# EAGLE design mubi-bot-PICO-2 (EAGLE 7.2.0)
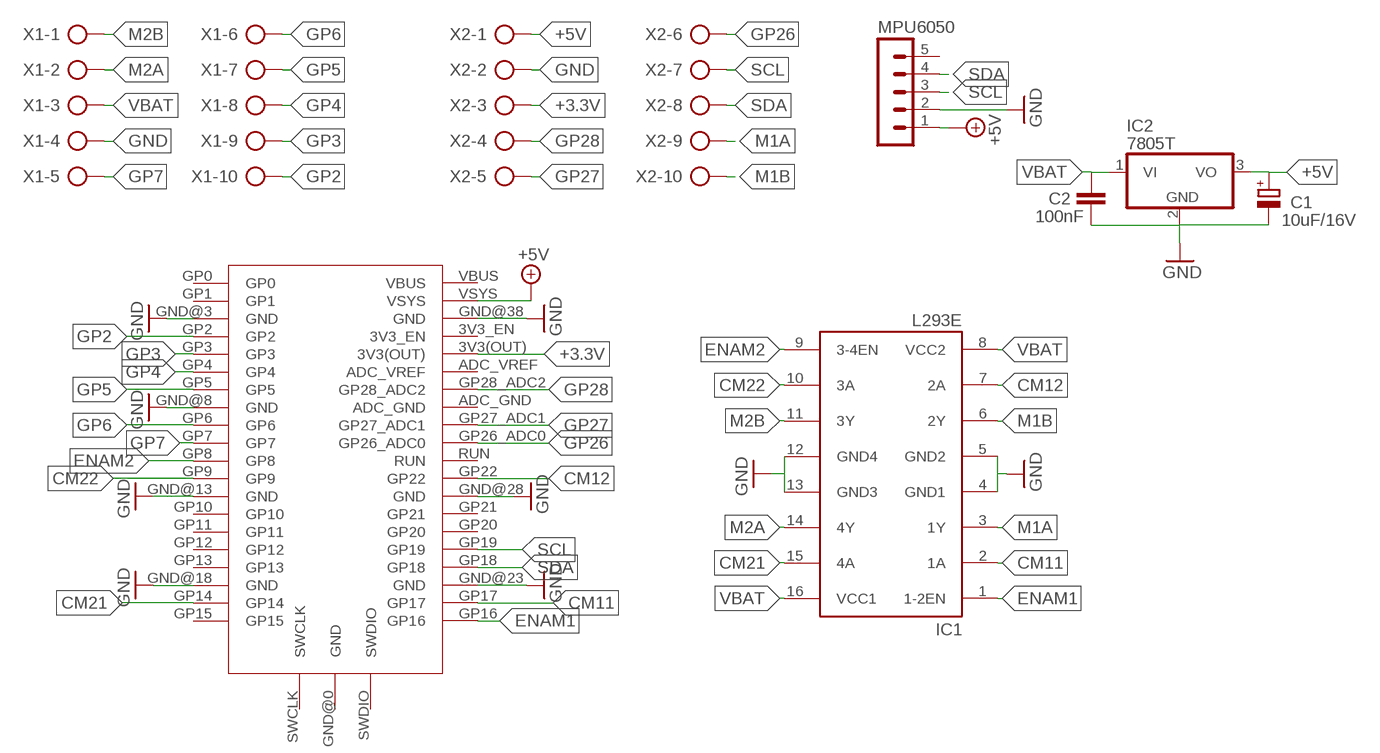
[diagram p0: schematic, sheet 1]

## Parts
C1  10uF/16V  CPOL-EUE2.5-5  [E2,5-5]
C2  100nF  C-EU025-025X050  [C025-025X050]
IC1  L293E  [DIL16]
IC2  7805T  [TO220H]
MPU6050  MA05-1  [MA05-1]
U$2  RASPBERRY_PI_PICO  [RASPBERRY_PI_PICO_FOOTPRINT]
X1  AK500/10-H  [AK500/10-H]
X2  AK500/10-H  [AK500/10-H]

## Nets
+3.3V: U$2.3V3(OUT) X2.3
+5V: C1.+ IC2.3(VO) MPU6050.1 U$2.VSYS X2.1
CM11: IC1.2(1A) U$2.GP17
CM12: IC1.7(2A) U$2.GP22
CM21: IC1.15(4A) U$2.GP14
CM22: IC1.10(3A) U$2.GP9
ENAM1: IC1.1(1-2EN) U$2.GP16
ENAM2: IC1.9(3-4EN) U$2.GP8
GND: C1.- C2.2 IC1.4(GND1) IC1.5(GND2) IC1.12(GND4) IC1.13(GND3) IC2.2(GND) MPU6050.2 U$2.GND@3(GND) U$2.GND@8(GND) U$2.GND@13(GND) U$2.GND@18(GND) U$2.GND@23(GND) U$2.GND@28(GND) U$2.GND@38(GND) X1.4 X2.2
GP2: U$2.GP2 X1.10
GP3: U$2.GP3 X1.9
GP4: U$2.GP4 X1.8
GP5: U$2.GP5 X1.7
GP6: U$2.GP6 X1.6
GP7: U$2.GP7 X1.5
GP26: U$2.GP26_ADC0 X2.6
GP27: U$2.GP27_ADC1 X2.5
GP28: U$2.GP28_ADC2 X2.4
M1A: IC1.3(1Y) X2.9
M1B: IC1.6(2Y) X2.10
M2A: IC1.14(4Y) X1.2
M2B: IC1.11(3Y) X1.1
SCL: MPU6050.3 U$2.GP19 X2.7
SDA: MPU6050.4 U$2.GP18 X2.8
VBAT: C2.1 IC1.8(VCC2) IC1.16(VCC1) IC2.1(VI) X1.3
Unconnected: MPU6050.5 U$2.3V3_EN U$2.ADC_GND U$2.ADC_VREF U$2.GND@0(GND) U$2.GP0 U$2.GP1 U$2.GP10 U$2.GP11 U$2.GP12 U$2.GP13 U$2.GP15 U$2.GP20 U$2.GP21 U$2.RUN U$2.SWCLK U$2.SWDIO U$2.VBUS

## Library data of the parts
C1 = rcl:CPOL-EU: POLARIZED CAPACITOR, European symbol
C2 = rcl:C-EU: CAPACITOR, European symbol
IC1 = texas:L293E: TI DEVICE; MF: Arrow Electronics; MPN: L293E; OC_FARNELL: 1467711; OC_NEWARK: 89K0732
IC2 = linear:78*: Positive VOLTAGE REGULATOR Source: http://cache.national.com/ds/LM/LM78L05.pdf http://www.fairchildsemi.com/ds/LM/LM7805.pdf
MPU6050 = con-lstb:MA05-1: PIN HEADER; OC_FARNELL: unknown; OC_NEWARK: unknown
U$2 = Raspberry Pi Pico v1:RASPBERRY_PI_PICO
X1 X2 = con-ptr500:AK500/10-H: CONNECTOR Aug. 2004 / PTR Meßtechnik: Die Bezeichnung der Serie AK505 wurde geändert. Es handelt sich hierbei um AK500 in horizontaler Ausführung.; OC_FARNELL: unknown; OC_NEWARK: unknown

## Net classes
0 default: clearance 0.205 mm

## Board
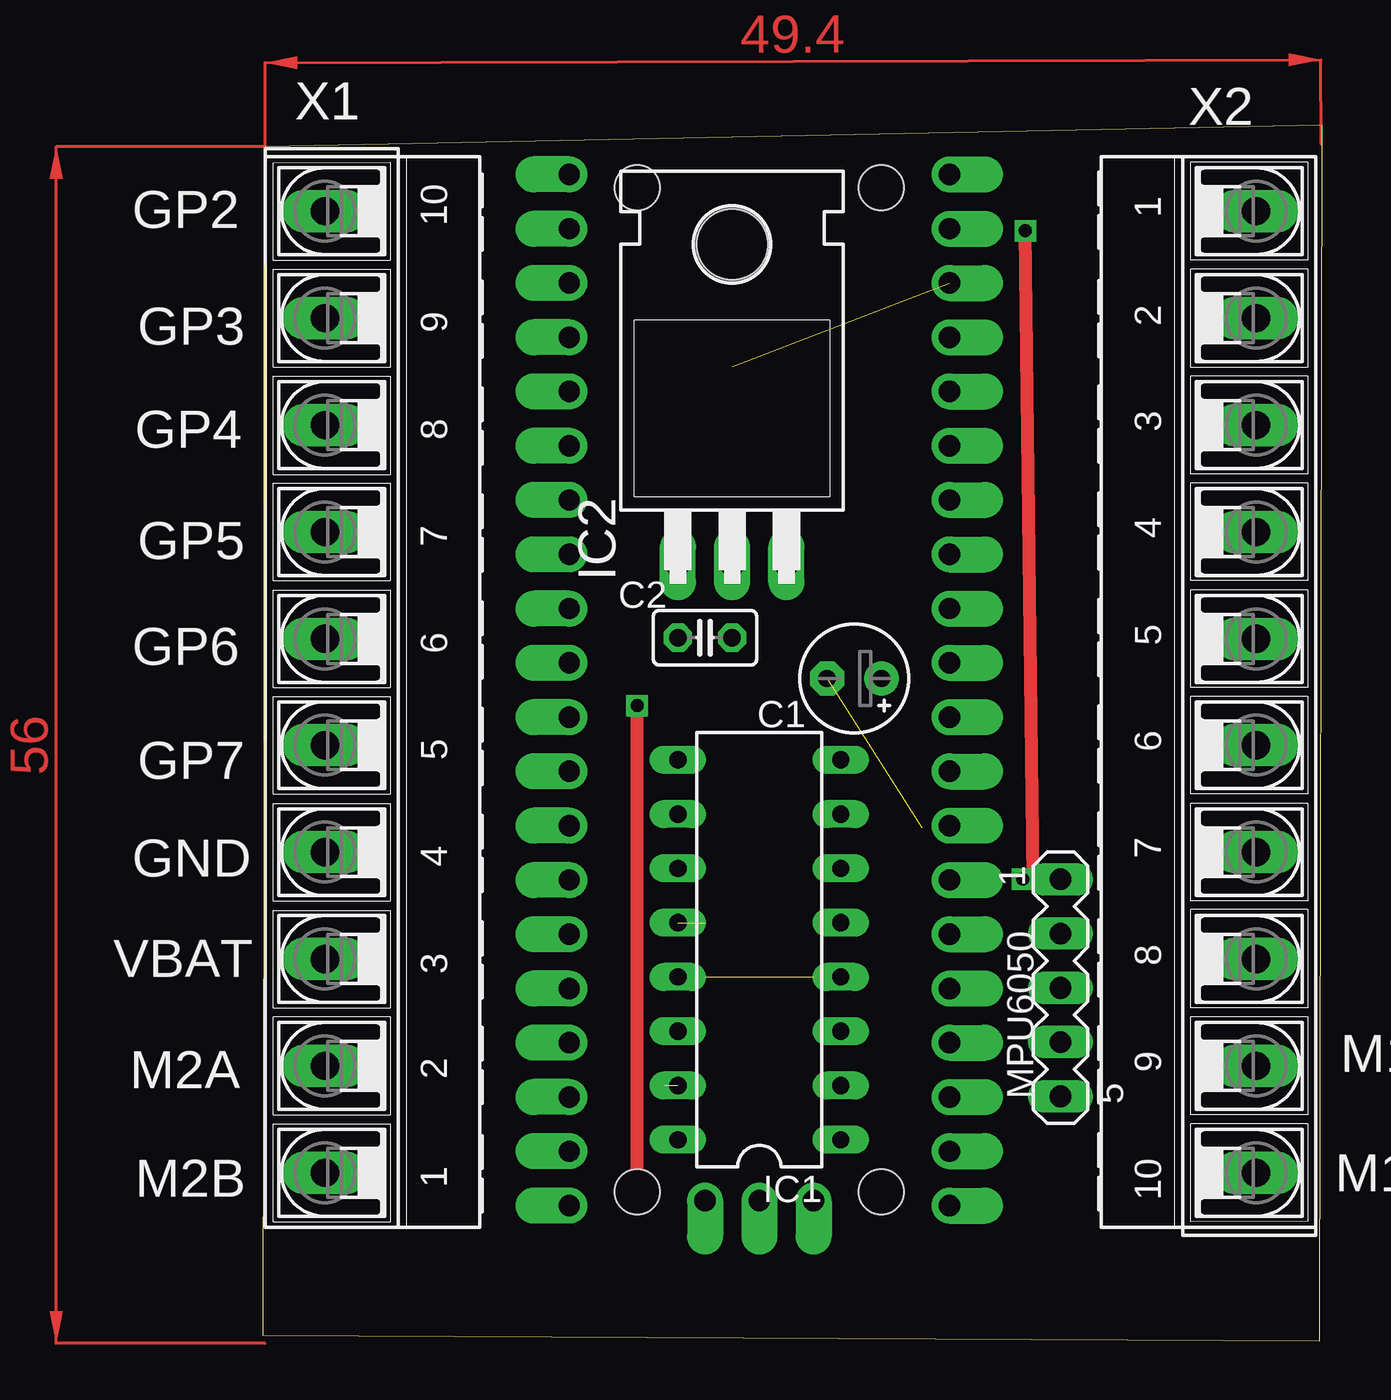
[diagram p1: board, top side]
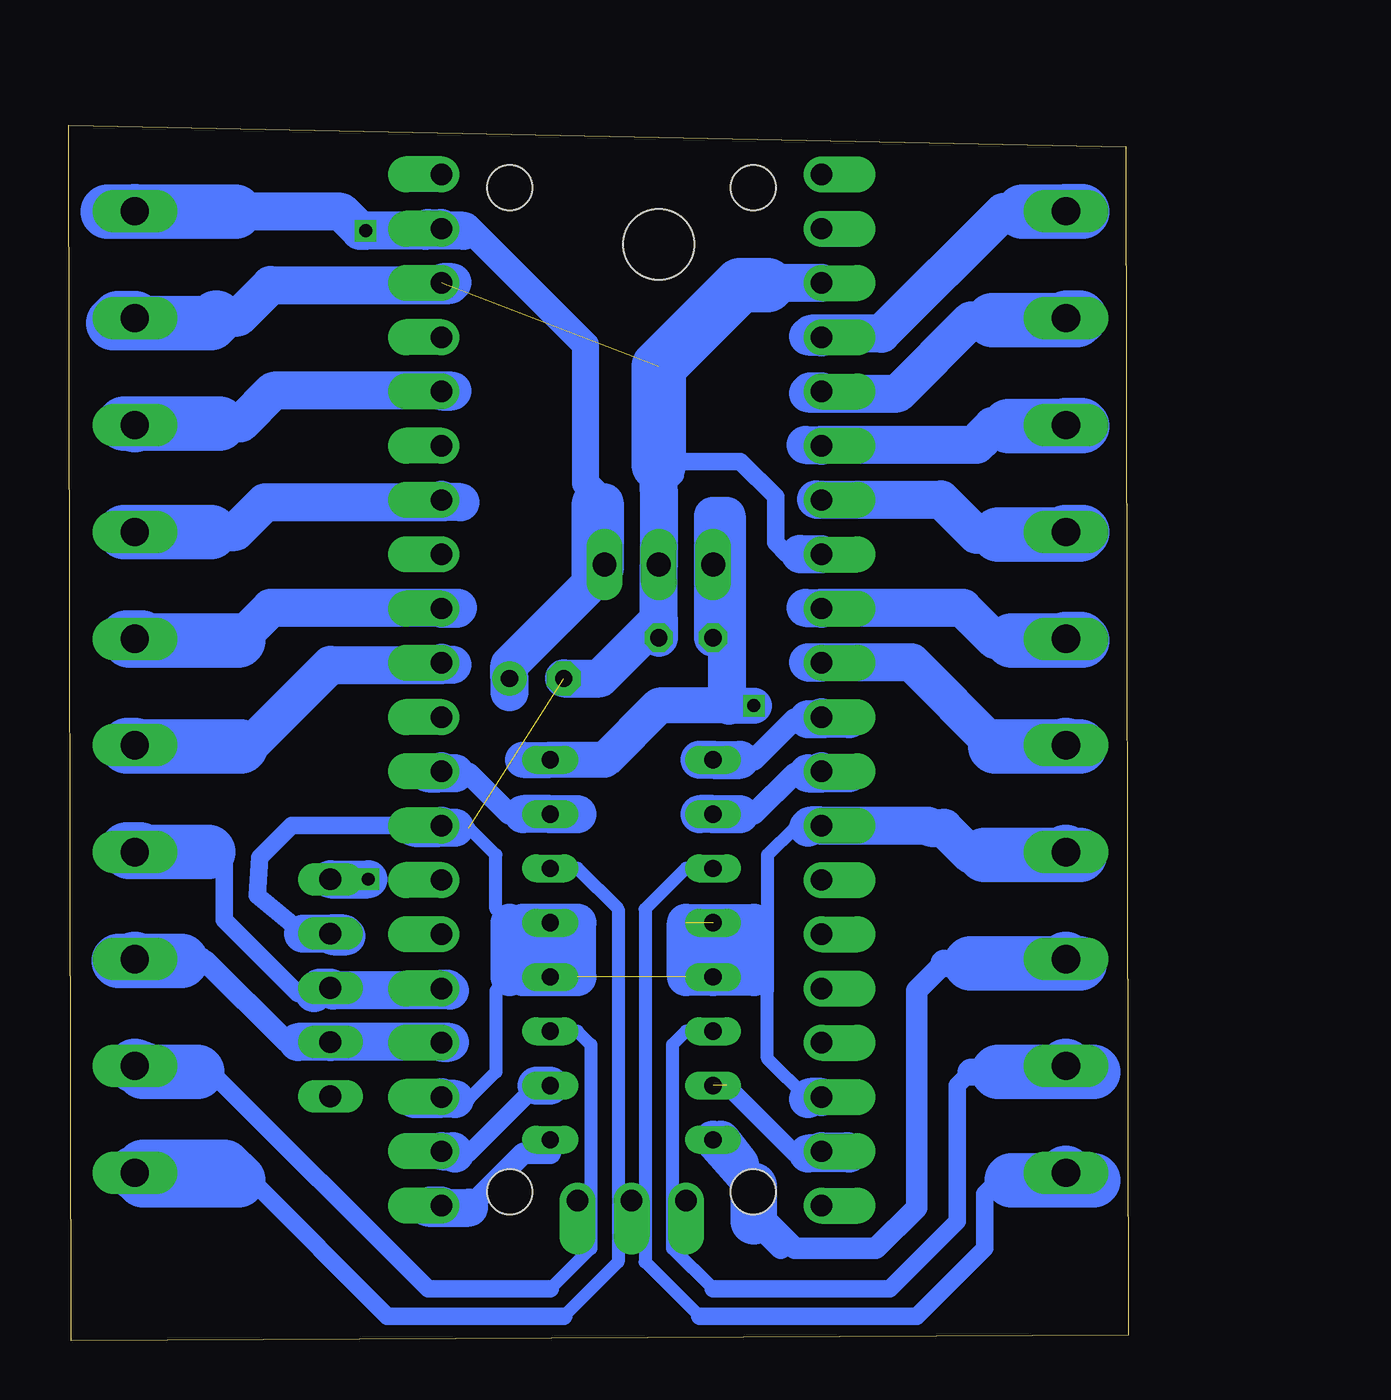
[diagram p2: board, bottom side, seen from below]

Size 49.58 x 56.89 mm. Coordinates in mm from the lower left corner, seen from the top.
Outline: 0,0.25 49.45,0 49.58,56.89 0.13,55.87 0,0.25
Copper layers (1*16): Top 0.035mm / dielectric 1.5mm / Bottom 0.035mm
Design rules "default": minimum track width 6mil, minimum drill 0.35mm, track to track 6mil, track to pad 6mil, pad to pad 6mil, via to via 6mil, smd to smd 6mil, copper to edge 40mil, drill to drill 6mil, minimum pad ring 10mil, minimum via ring 8mil, stop-mask expansion 4mil, vias tented up to drill 0mil, thermal gap 10mil

### Footprints (pad centres in the part's own frame; a part is rotated, then mirrored left to right if it is on the bottom)
E2,5-5 = drill 0.813 pad 1.6: + -1.27,0 | drill 0.813 pad 1.6 octagon: - 1.27,0
C025-025X050 = drill 0.813 octagon: 1 -1.27,0; 2 1.27,0
DIL16 = drill 0.813 long: 1 -8.89,-3.81; 2 -6.35,-3.81; 3 -3.81,-3.81; 4 -1.27,-3.81; 5 1.27,-3.81; 6 3.81,-3.81; 7 6.35,-3.81; 8 8.89,-3.81; 9 8.89,3.81; 10 6.35,3.81; 11 3.81,3.81; 12 1.27,3.81; 13 -1.27,3.81; 14 -3.81,3.81; 15 -6.35,3.81; 16 -8.89,3.81
TO220H = drill 1.118 long: 1 -2.54,-10.16; 2 0,-10.16; 3 2.54,-10.16 | hole 3.302: 0,4.826
MA05-1 = drill 1.016 long: 1 -5.08,0; 2 -2.54,0; 3 0,0; 4 2.54,0; 5 5.08,0
RASPBERRY_PI_PICO_FOOTPRINT = drill 1 pad 1.676 offset: 3V3(OUT) 8.89,39.465; 3V3_EN 8.89,42.005; ADC_GND 8.89,31.845; ADC_VREF 8.89,36.925; GND@0 0,1.6; GND@3 -8.89,44.545; GND@8 -8.89,31.845; GND@13 -8.89,19.145; GND@18 -8.89,6.445; GND@23 8.89,6.445; GND@28 8.89,19.145; GND@38 8.89,44.545; GP0 -8.89,49.625; GP1 -8.89,47.085; GP2 -8.89,42.005; GP3 -8.89,39.465; GP4 -8.89,36.925; GP5 -8.89,34.385; GP6 -8.89,29.305; GP7 -8.89,26.765; GP8 -8.89,24.225; GP9 -8.89,21.685; GP10 -8.89,16.605; GP11 -8.89,14.065; GP12 -8.89,11.525; GP13 -8.89,8.985; GP14 -8.89,3.905; GP15 -8.89,1.365; GP16 8.89,1.365; GP17 8.89,3.905; GP18 8.89,8.985; GP19 8.89,11.525; GP20 8.89,14.065; GP21 8.89,16.605; GP22 8.89,21.685; GP26_ADC0 8.89,26.765; GP27_ADC1 8.89,29.305; GP28_ADC2 8.89,34.385; RUN 8.89,24.225; SWCLK -2.54,1.6; SWDIO 2.54,1.6; VBUS 8.89,49.625; VSYS 8.89,47.085 | hole 2.1: 5.7,2; 5.7,49; -5.7,49; -5.7,2
AK500/10-H = drill 1.321 long: 1 -22.504,0; 2 -17.501,0; 3 -12.497,0; 4 -7.493,0; 5 -2.489,0; 6 2.489,0; 7 7.493,0; 8 12.497,0; 9 17.501,0; 10 22.504,0

### Placement (x,y rotation side)
C1  27.69,30.99 180 top
C2  20.7,32.89 0 top
IC1  23.24,18.29 90 top
IC2  21.97,46.48 0 top
MPU6050  37.34,16.51 270 top
U$2  23.24,4.95 0 top
X1  2.92,30.35 90 top
X2  46.48,30.35 270 top

### Tracks (layer width: path | path; a pad name or v marks a point on that pad's centre or on a via)
+3.3V
  Bottom 1.778: U$2.3V3(OUT) 31.65,44.42 31.62,44.45 40,44.45 41.53,42.93 42.54,42.93
  Bottom 2.54: 42.54,42.93 46.18,42.93 | 46.99,42.93 46.18,42.93 | 46.18,42.93 X2.3
+5V  (via drill 0.6)
  Top 0.61: v35.56,21.59 36.07,21.59 v35.69,51.94
  Bottom 1.27: IC2.3 24.51,39.24 25.4,40.13 25.4,46.59 30.74,51.93 31.11,51.93 31.11,51.94
  Bottom 1.778: 28.96,30.35 C1.+ 28.96,31.62 25.15,35.43 | 25.15,35.43 24.51,36.07 24.51,39.24 25.15,39.24 | 25.15,35.43 25.15,39.24 | IC2.3 24.51,38.61 25.15,39.24 | 31.11,51.94 32.89,51.94 | 32.89,51.94 32.77,52.07 32.16,52.07 U$2.VSYS | MPU6050.1 v35.56,21.59 | 32.89,51.94 v35.69,51.94 35.94,51.94 36.83,52.83 41.78,52.83
  Bottom 2.54: 41.78,52.83 46.13,52.83 | 47.75,52.83 46.13,52.83 | 46.13,52.83 X2.1
CM11
  Bottom 0.813: 31.5,8.76 30.86,8.76 27.69,11.94
  Bottom 1.778: U$2.GP17 31.59,8.86 31.5,8.76 | 27.69,11.94 IC1.2
CM12
  Bottom 1.016: 28.32,24.64 28.96,24.64 30.86,26.54 31.5,26.54
  Bottom 1.778: 25.78,24.64 IC1.7 28.32,24.64 | 31.5,26.54 32.23,26.54 | 32.77,26.54 32.23,26.54 | 32.23,26.54 U$2.GP22
CM21  (1 unrouted)
  Bottom 0.813: 14.99,8.76 15.62,8.76 18.8,11.94
  Bottom 1.778: U$2.GP14 13.18,8.86 13.08,8.76 14.99,8.76
CM22
  Bottom 1.016: 18.16,24.64 17.53,24.64 15.62,26.54 14.99,26.54
  Bottom 1.778: 20.07,24.64 IC1.10 18.16,24.64 | 14.99,26.54 14.26,26.54 | 13.08,26.54 14.26,26.54 | 14.26,26.54 U$2.GP9
ENAM1
  Bottom 1.016: 30.86,6.22 28.32,8.76 27.05,8.76 IC1.1
  Bottom 1.778: U$2.GP16 32.67,6.32 32.77,6.22 30.86,6.22
ENAM2
  Bottom 1.016: 18.16,27.18 17.53,27.18 15.62,29.08 14.99,29.08
  Bottom 1.778: 20.07,27.18 IC1.9 18.16,27.18 | 14.99,29.08 14.26,29.08 | 13.08,29.08 14.26,29.08 | 14.26,29.08 U$2.GP8
GND  (4 unrouted)
  Bottom 0.61: 14.99,11.3 16.89,13.21 16.89,16.38 | 16.89,16.38 17.53,17.02 | 14.99,24 15.62,24 16.89,22.73 16.89,16.38 | 28.32,19.56 28.96,19.56 29.59,20.19 29.59,22.73 30.86,24 31.5,24 | 28.96,17.02 29.59,16.38 29.59,12.57 30.86,11.3 31.5,11.3
  Bottom 0.813: 15.37,36.83 16,36.83 16.51,37.34 16.51,39.5 18.16,41.15 21.21,41.15 21.21,40.49 21.97,39.73 | U$2.GND@28 39.15,24.1 40.64,22.61 40.77,20.83 38.61,19.05
  Bottom 1.778: U$2.GND@18 14.89,11.4 14.99,11.3 | IC1.13 17.53,17.02 17.53,17.65 | IC1.13 20.7,17.02 20.7,19.56 17.53,19.56 17.53,17.65 | 17.53,17.65 18.16,18.29 19.43,18.29 IC1.13 | 28.32,17.02 28.32,19.56 IC1.5 25.78,19.56 25.78,17.02 IC1.4 28.32,17.02 | 14.99,24 14.89,24.1 U$2.GND@13 9.37,24.1 9.27,24 8.64,24 7.37,22.73 6.73,22.73 | 31.5,24 32.23,24 | 33.4,24 32.23,24 | 32.23,24 U$2.GND@28 | 28.32,17.02 27.05,18.29 27.69,18.29 28.96,19.56 28.96,17.02 | 31.5,11.3 32.23,11.3 | 33.4,11.3 32.23,11.3 | 32.23,11.3 U$2.GND@23 | 21.97,33.74 C2.2 | 21.97,33.74 IC2.2 21.97,39.73 21.97,41 21.97,43.69 | C1.- 24.73,30.99 21.97,33.74 | U$2.GND@3 16.8,49.5 16.89,49.4 | U$2.GND@8 15.34,36.8 15.37,36.83 | 38.61,19.05 MPU6050.2 | MPU6050.2 36.7,19.05 36.58,18.92 37.21,18.92 MPU6050.2 | 42.67,47.88 41.66,47.88 40.13,49.4 31.75,49.4 31.62,49.53 32.1,49.53 U$2.GND@38
  Bottom 2.54: 6.73,22.73 2.79,22.73 | 2.29,22.73 2.79,22.73 | 2.79,22.73 X1.4 | 16.89,49.4 18.16,49.4 21.97,45.59 21.97,41 | X2.2 47.27,47.85 47.5,47.62 42.93,47.62 42.67,47.88
GP2
  Bottom 1.778: 4.95,52.83 5.84,52.83 11.56,47.12 14.86,47.12 14.99,46.99 14.38,46.99 U$2.GP2
  Bottom 2.54: X1.10 2.18,52.86 2.16,52.83 4.95,52.83
GP3
  Bottom 1.778: U$2.GP3 14.89,44.42 14.99,44.32 10.79,44.32 7.37,47.75 6.35,47.75
  Bottom 2.54: 6.35,47.75 2.41,47.75 2.29,47.88 2.9,47.88 X1.9
GP4
  Bottom 1.778: 5.59,42.8 6.35,42.8 6.86,42.29 6.86,42.16 7.11,41.91 14.38,41.91 | 15.11,41.91 14.38,41.91 | 14.38,41.91 U$2.GP4
  Bottom 2.54: X1.8 2.21,42.85 2.16,42.8 5.59,42.8
GP5
  Bottom 1.778: U$2.GP5 14.57,39.34 14.61,39.37 8.76,39.37 7.11,37.72 6.1,37.72
  Bottom 2.54: 6.1,37.72 2.29,37.72 2.16,37.85 X1.7
GP6
  Bottom 1.778: 5.46,32.77 6.22,32.77 7.75,34.29 14.38,34.29 | 15.11,34.29 14.38,34.29 | 14.38,34.29 U$2.GP6
  Bottom 2.54: X1.6 2.24,32.84 2.16,32.77 5.46,32.77
GP7
  Bottom 1.778: U$2.GP7 14.95,31.72 14.99,31.75 10.16,31.75 6.22,27.81
  Bottom 2.54: 6.22,27.81 2.87,27.81 | 2.29,27.81 2.87,27.81 | 2.87,27.81 X1.5
GP26
  Bottom 1.778: 41.53,27.81 41.15,27.81 37.34,31.62 32.04,31.62 | 31.62,31.62 32.04,31.62 | 32.04,31.62 U$2.GP26_ADC0
  Bottom 2.54: X2.6 46.81,27.86 46.86,27.81 41.53,27.81
GP27
  Bottom 1.778: U$2.GP27_ADC1 31.4,34.26 31.37,34.29 40.13,34.29 41.66,32.77
  Bottom 2.54: 41.66,32.77 46.74,32.77 46.86,32.89 46.15,32.89 X2.5
GP28
  Bottom 1.778: 42.93,37.85 41.78,37.85 40.39,39.24 32.04,39.24 | 31.24,39.24 32.04,39.24 | 32.04,39.24 U$2.GP28_ADC2
  Bottom 2.54: 46.99,37.85 X2.4 42.93,37.85
M1A
  Bottom 0.61: IC1.3 25.78,14.48 25.15,13.84 25.15,4.32 27.05,2.41
  Bottom 0.813: 27.05,2.41 32.77,2.41 42.93,12.57 43.56,12.57
  Bottom 2.54: 43.56,12.57 45.74,12.57 | 46.1,12.57 45.74,12.57 | 45.74,12.57 X2.9
M1B
  Bottom 0.61: IC1.6 25.78,22.1 23.88,20.19 23.88,3.68 26.42,1.14
  Bottom 0.813: 26.42,1.14 34.67,1.14 41.02,7.49 41.66,7.49
  Bottom 2.54: 45.11,7.49 46.1,7.49 46.1,8.13 42.29,8.13 41.66,7.49 45.11,7.49 | 45.11,7.49 X2.10
M2A
  Bottom 0.61: IC1.14 20.7,14.48 21.34,13.84 21.34,4.32 19.43,2.41
  Bottom 0.813: 19.43,2.41 11.18,2.41 8,5.59 8,11.94 7.37,12.57
  Bottom 1.27: 7.37,12.57 6.1,12.57
  Bottom 2.54: 6.1,12.57 2.64,12.57 | 1.65,12.57 2.64,12.57 | 2.64,12.57 X1.2
M2B
  Bottom 0.61: IC1.11 20.7,22.1 22.61,20.19 22.61,3.68 20.07,1.14
  Bottom 0.813: 20.07,1.14 9.91,1.14 6.73,4.32 6.73,6.86 6.1,7.49 5.46,7.49
  Bottom 2.54: 5.46,7.49 2.57,7.49 | 1.65,7.49 2.57,7.49 | 2.57,7.49 X1.1
SCL
  Bottom 0.813: 38.1,16.26 38.86,16.26 42.29,19.68 42.29,22.48 43.18,22.86 43.05,22.86
  Bottom 1.778: U$2.GP19 31.85,16.48 31.75,16.38 37.21,16.38 MPU6050.3 37.85,16.51 38.1,16.26
  Bottom 2.54: 43.05,22.86 X2.7 | X2.7 46.74,22.86 46.86,22.99 46.23,22.99 X2.7
SDA
  Bottom 1.016: 38.86,13.97 39.37,13.97 43.18,17.78 43.43,17.78
  Bottom 1.27: 43.43,17.78 44.32,17.78
  Bottom 1.778: U$2.GP18 31.78,13.94 31.75,13.97 MPU6050.4 38.86,13.97
  Bottom 2.54: 44.32,17.78 46.18,17.78 | 47.24,17.78 46.18,17.78 | 46.18,17.78 X2.8
VBAT  (via drill 0.6)
  Top 0.61: v17.53,7.24 v17.53,29.72
  Bottom 1.016: 17.53,5.59 16.26,4.32 | 18.16,8.25 18.16,6.86 15.62,4.32 11.81,4.32 9.91,6.22 9.91,16.38 8.64,17.65
  Bottom 1.27: 8.64,17.65 7.37,17.65
  Bottom 1.676: v17.53,29.72 18.69,29.72 21.97,29.72 24.51,27.18 IC1.8 28.32,27.18
  Bottom 1.778: IC1.16 19.05,9.4 18.16,8.25 18.8,8.76 IC1.16 | IC1.16 v17.53,7.24 | 18.69,29.72 18.8,29.83 18.8,38.61 19.43,38.61 IC2.1 C2.1
  Bottom 2.184: v17.53,7.24 17.53,5.59
  Bottom 2.54: 7.37,17.65 2.72,17.65 | 2.29,17.65 2.72,17.65 | 2.72,17.65 X1.3
(copper drawn outside any net)
  shapes: Top area x2

### Text on the board
tNames: GP2 | GP3 | GP4 | GP5 | GP6 | GP7 | GND | VBAT | M1A | M2A | M2B | M1B
tValues: +5V_out | GND | +3,3V_out | GP28 | GP27 | GP26 | SCL_GP19 | SDA_GP18